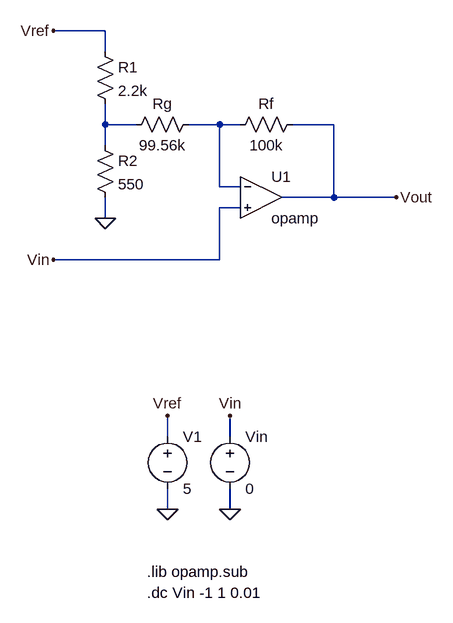
[diagram p0: schematic mpbn.asc]
mpbn.asc, the LTspice schematic file:
Version 4
SHEET 1 880 800
WIRE -32 -80 -112 -80
WIRE -32 -48 -32 -80
WIRE -32 64 -32 32
WIRE 16 64 -32 64
WIRE 144 64 96 64
WIRE 176 64 144 64
WIRE 320 64 256 64
WIRE -32 96 -32 64
WIRE 144 160 144 64
WIRE 176 160 144 160
WIRE 320 176 320 64
WIRE 320 176 240 176
WIRE 416 176 320 176
WIRE 176 192 144 192
WIRE -32 208 -32 176
WIRE 144 272 144 192
WIRE 144 272 -112 272
WIRE 64 544 64 512
WIRE 160 544 160 512
WIRE 64 656 64 624
WIRE 160 656 160 624
FLAG 64 512 Vref
FLAG 64 656 0
FLAG 160 656 0
FLAG -112 -80 Vref
FLAG 416 176 Vout
FLAG -32 208 0
FLAG -112 272 Vin
FLAG 160 512 Vin
SYMBOL voltage 160 528 R0
SYMATTR InstName Vin
SYMATTR Value 0
SYMBOL res 272 48 R90
WINDOW 0 0 56 VBottom 2
WINDOW 3 32 56 VTop 2
SYMATTR InstName Rf
SYMATTR Value 100k
SYMBOL res 112 48 R90
WINDOW 0 0 56 VBottom 2
WINDOW 3 32 56 VTop 2
SYMATTR InstName Rg
SYMATTR Value 99.56k
SYMBOL res -48 80 R0
SYMATTR InstName R2
SYMATTR Value 550
SYMBOL res -48 -64 R0
SYMATTR InstName R1
SYMATTR Value 2.2k
SYMBOL voltage 64 528 R0
SYMATTR InstName V1
SYMATTR Value 5
SYMBOL Opamps\\opamp 208 112 R0
SYMATTR InstName U1
TEXT 32 784 Left 2 !.dc Vin -1 1 0.01
TEXT 32 752 Left 2 !.lib opamp.sub

The netlist it stands for:
* mpbn.asc
Vin Vin 0 0
Rf Vout N002 100k
Rg N002 N001 99.56k
R2 N001 0 550
R1 Vref N001 2.2k
V1 Vref 0 5
XU1 N002 Vin Vout opamp Aol=100K GBW=10Meg  ; pins invin noninvin out
.dc Vin -1 1 0.01
.lib opamp.sub
.backanno
.end